# EAGLE design EggDuino77 (EAGLE 7.7.0)
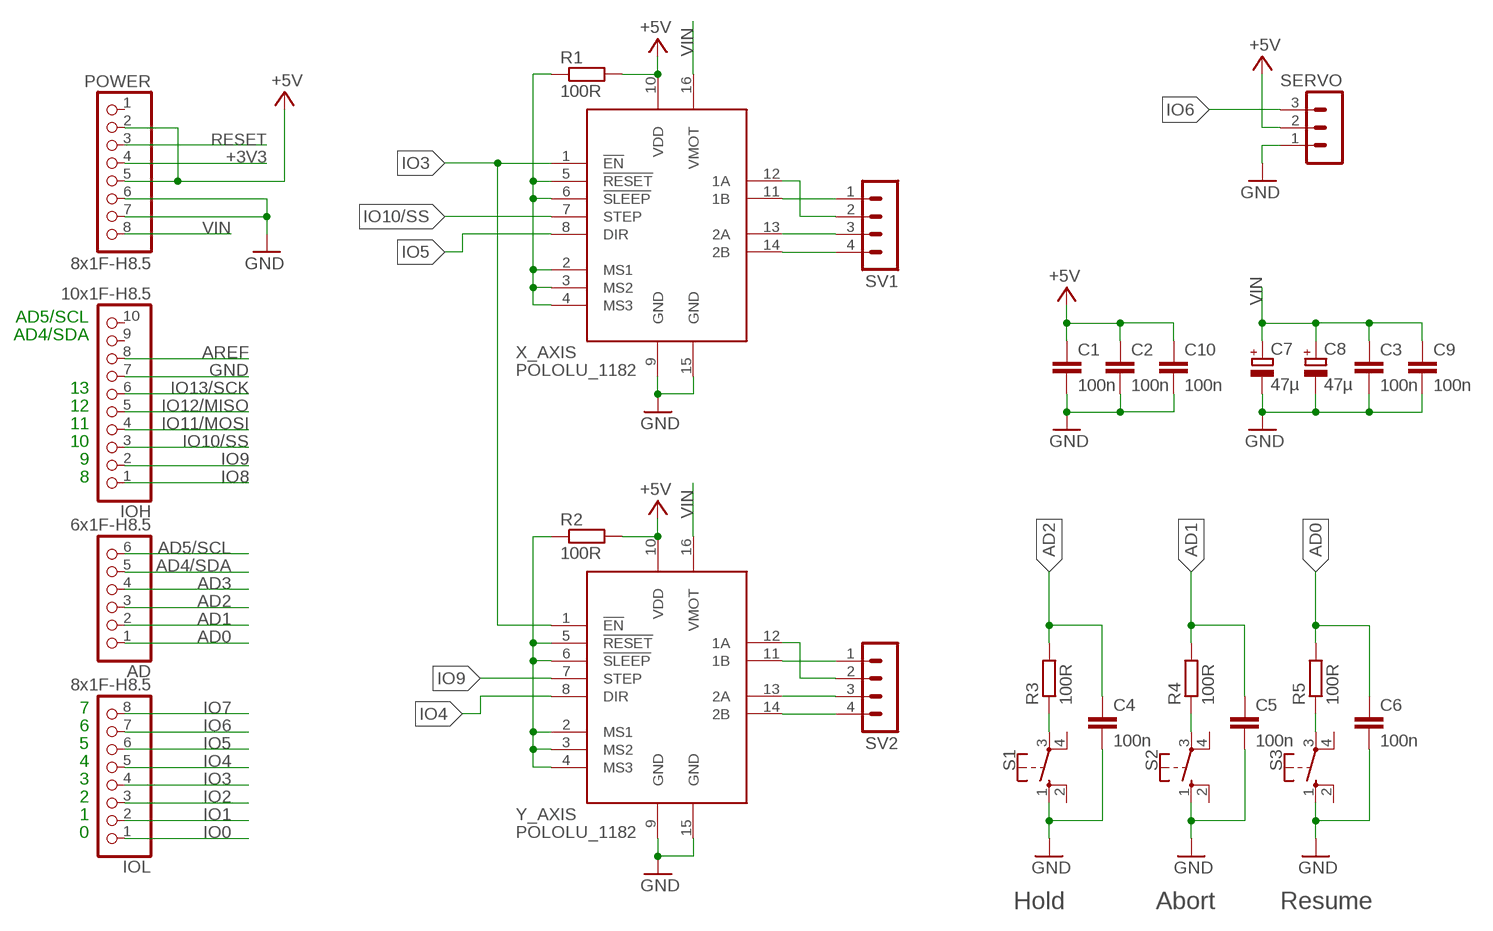
[diagram p0: schematic, sheet 1]

## Parts
AD  6x1F-H8.5  PINHD-1X6  [1X06]
C1  100n  C-EUC0805  [C0805]
C2  100n  C-EUC0805  [C0805]
C3  100n  C-EUC0805  [C0805]
C4  100n  C-EUC0805  [C0805]
C5  100n  C-EUC0805  [C0805]
C6  100n  C-EUC0805  [C0805]
C7  47µ  CPOL-EUE2,5-6E  [E2,5-6E]
C8  47µ  CPOL-EUE2,5-6E  [E2,5-6E]
C9  100n  C-EUC0805  [C0805]
C10  100n  C-EUC0805  [C0805]
IOH  10x1F-H8.5  PINHD-1X10_ARD  [1X10]
IOL  8x1F-H8.5  PINHD-1X8  [1X08]
POWER  8x1F-H8.5  PINHD-1X8  [1X08]
R1  100R  R-EU_R0805  [R0805]
R2  100R  R-EU_R0805  [R0805]
R3  100R  R-EU_R0805  [R0805]
R4  100R  R-EU_R0805  [R0805]
R5  100R  R-EU_R0805  [R0805]
S1  10-XX  [B3F-10XX]
S2  10-XX  [B3F-10XX]
S3  10-XX  [B3F-10XX]
SERVO  MA03-1  [MA03-1]
SV1  MA04-1  [MA04-1]
SV2  MA04-1  [MA04-1]
X_AXIS  POLOLU_1182  [DIL16_WIDE]
Y_AXIS  POLOLU_1182  [DIL16_WIDE]

## Nets
+3V3: POWER.4
+5V [usbvcc]: C1.1 C2.1 C10.1 POWER.2 POWER.5 R1.2 R2.2 SERVO.2 X_AXIS.10(VDD) Y_AXIS.10(VDD)
AD0: AD.1 C6.1 R5.2
AD1: AD.2 C5.1 R4.2
AD2: AD.3 C4.1 R3.2
AD3: AD.4
AD4/SDA: AD.5
AD5/SCL: AD.6
AREF [aref]: IOH.8
GND [gnd]: C1.2 C2.2 C3.2 C4.2 C5.2 C6.2 C7.- C8.- C9.2 C10.2 IOH.7 POWER.6 POWER.7 S1.1(S) S2.1(S) S3.1(S) SERVO.1 X_AXIS.9(GND) X_AXIS.15(GND) Y_AXIS.9(GND) Y_AXIS.15(GND)
IO0: IOL.1
IO1: IOL.2
IO2: IOL.3
IO3: IOL.4 X_AXIS.1(!EN) Y_AXIS.1(!EN)
IO4: IOL.5 Y_AXIS.8(DIR)
IO5: IOL.6 X_AXIS.8(DIR)
IO6: IOL.7 SERVO.3
IO7: IOL.8
IO8: IOH.1
IO9: IOH.2 Y_AXIS.7(STEP)
IO10/SS: IOH.3 X_AXIS.7(STEP)
IO11/MOSI: IOH.4
IO12/MISO: IOH.5
IO13/SCK: IOH.6
N$1: R2.1 Y_AXIS.2(MS1) Y_AXIS.3(MS2) Y_AXIS.4(MS3) Y_AXIS.5(!RESET) Y_AXIS.6(!SLEEP)
N$2: R1.1 X_AXIS.2(MS1) X_AXIS.3(MS2) X_AXIS.4(MS3) X_AXIS.5(!RESET) X_AXIS.6(!SLEEP)
N$3: SV1.4 X_AXIS.14(2B)
N$4: SV1.3 X_AXIS.13(2A)
N$5: SV1.2 X_AXIS.12(1A)
N$6: SV1.1 X_AXIS.11(1B)
N$7: SV2.1 Y_AXIS.11(1B)
N$8: SV2.4 Y_AXIS.14(2B)
N$9: SV2.3 Y_AXIS.13(2A)
N$10: SV2.2 Y_AXIS.12(1A)
N$12: R3.1 S1.3(P)
N$15: R4.1 S2.3(P)
N$17: R5.1 S3.3(P)
RESET: POWER.3
VIN [power]: C3.1 C7.+ C8.+ C9.1 POWER.8 X_AXIS.16(VMOT) Y_AXIS.16(VMOT)
Unconnected: IOH.9 IOH.10 POWER.1 S1.2(S1) S1.4(P1) S2.2(S1) S2.4(P1) S3.2(S1) S3.4(P1)

## Notes on the sheet
- AD5/SCL
- AD4/SDA
- 13
- 12
- 11
- 10
- 9
- 8
- 7
- 6
- 5
- 4
- 3
- 2
- 1
- 0
- Hold | Abort | Resume

## Library data of the parts
AD = SmartPrj:PINHD-1X6: PIN HEADER
C1-C6 C9 C10 = rcl:C-EU: CAPACITOR, European symbol; OC_RS: KEM X7R0805 100N
C7 C8 = rcl:CPOL-EU: POLARIZED CAPACITOR, European symbol; OC_RS: RAD LXZ 50/47
IOH = SmartPrj:PINHD-1X10_ARD: PIN HEADER
IOL POWER = SmartPrj:PINHD-1X8: PIN HEADER
R1-R5 = rcl:R-EU_: RESISTOR, European symbol; OC_RS: SMD-0805 100
S1-S3 = switch-omron:10-XX: OMRON SWITCH; OC_RS: TASTER 9302
SERVO = con-lstb:MA03-1: PIN HEADER; OC_FARNELL: unknown; OC_NEWARK: unknown
SV1 SV2 = con-lstb:MA04-1: PIN HEADER; OC_FARNELL: unknown; OC_NEWARK: unknown
X_AXIS Y_AXIS = EggDuino77:POLOLU_1182: Pololu stepper driver based on the A4983.

## Net classes
0 default: width 0.254 mm, clearance 0.254 mm
1 power: width 0.61 mm, drill 0.61 mm, clearance 0.254 mm
2 gnd: width 0.305 mm, drill 0.559 mm, clearance 0.254 mm
3 usbvcc: width 0.508 mm, drill 0.61 mm, clearance 0.254 mm
4 aref: width 0.406 mm, drill 0.61 mm, clearance 0.254 mm

## Board
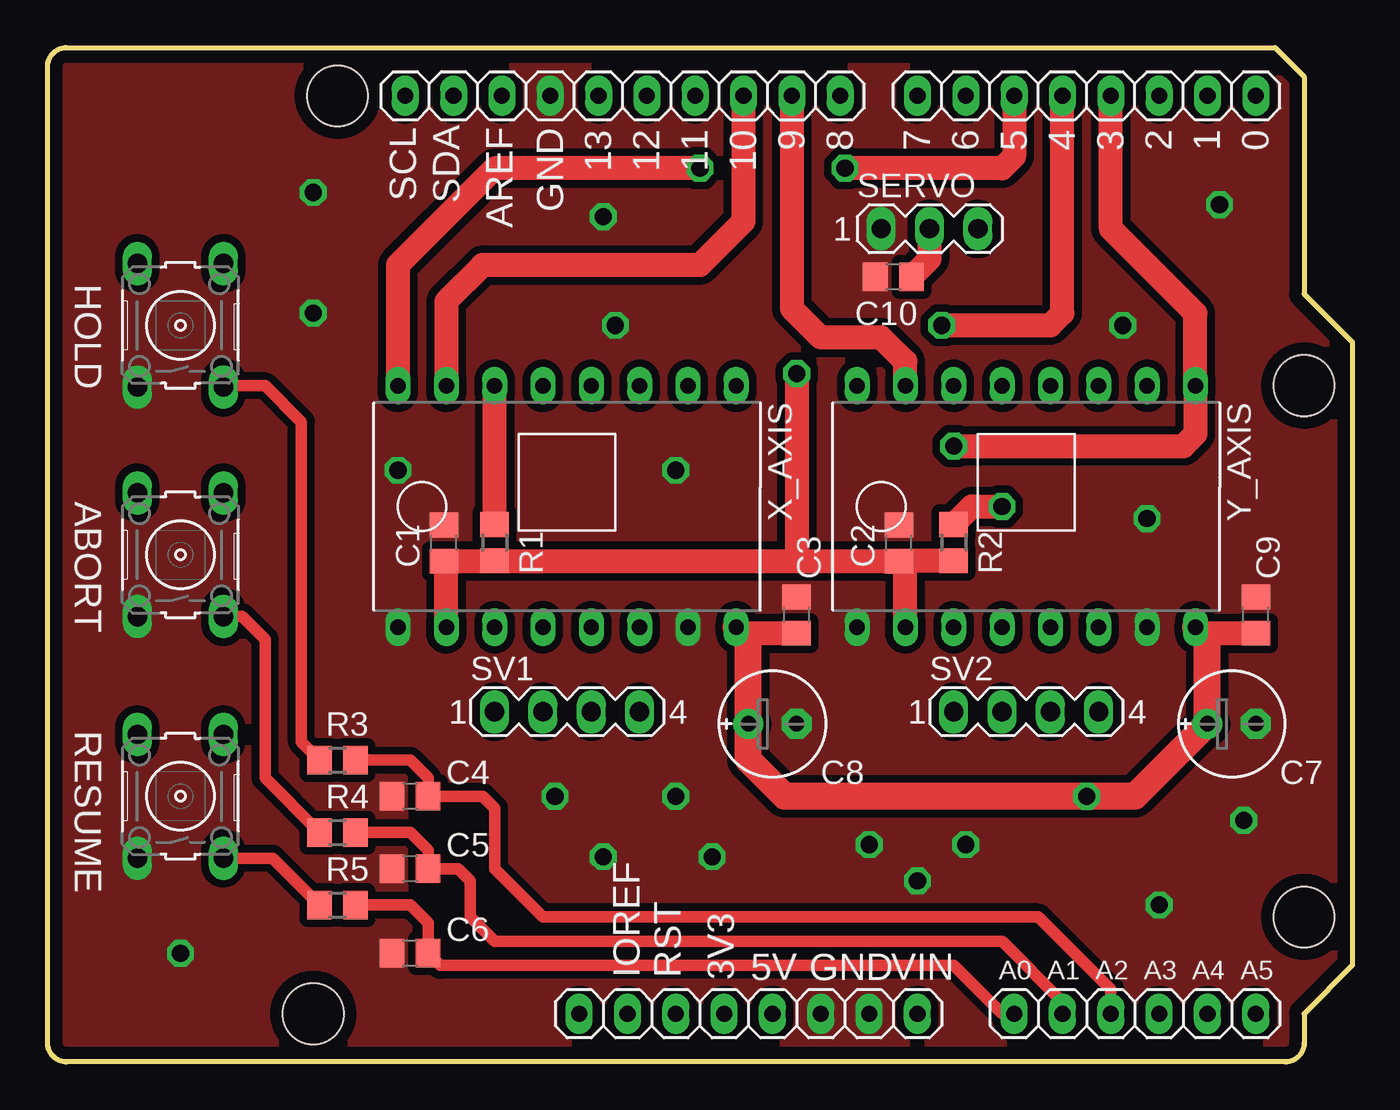
[diagram p1: board, top side]
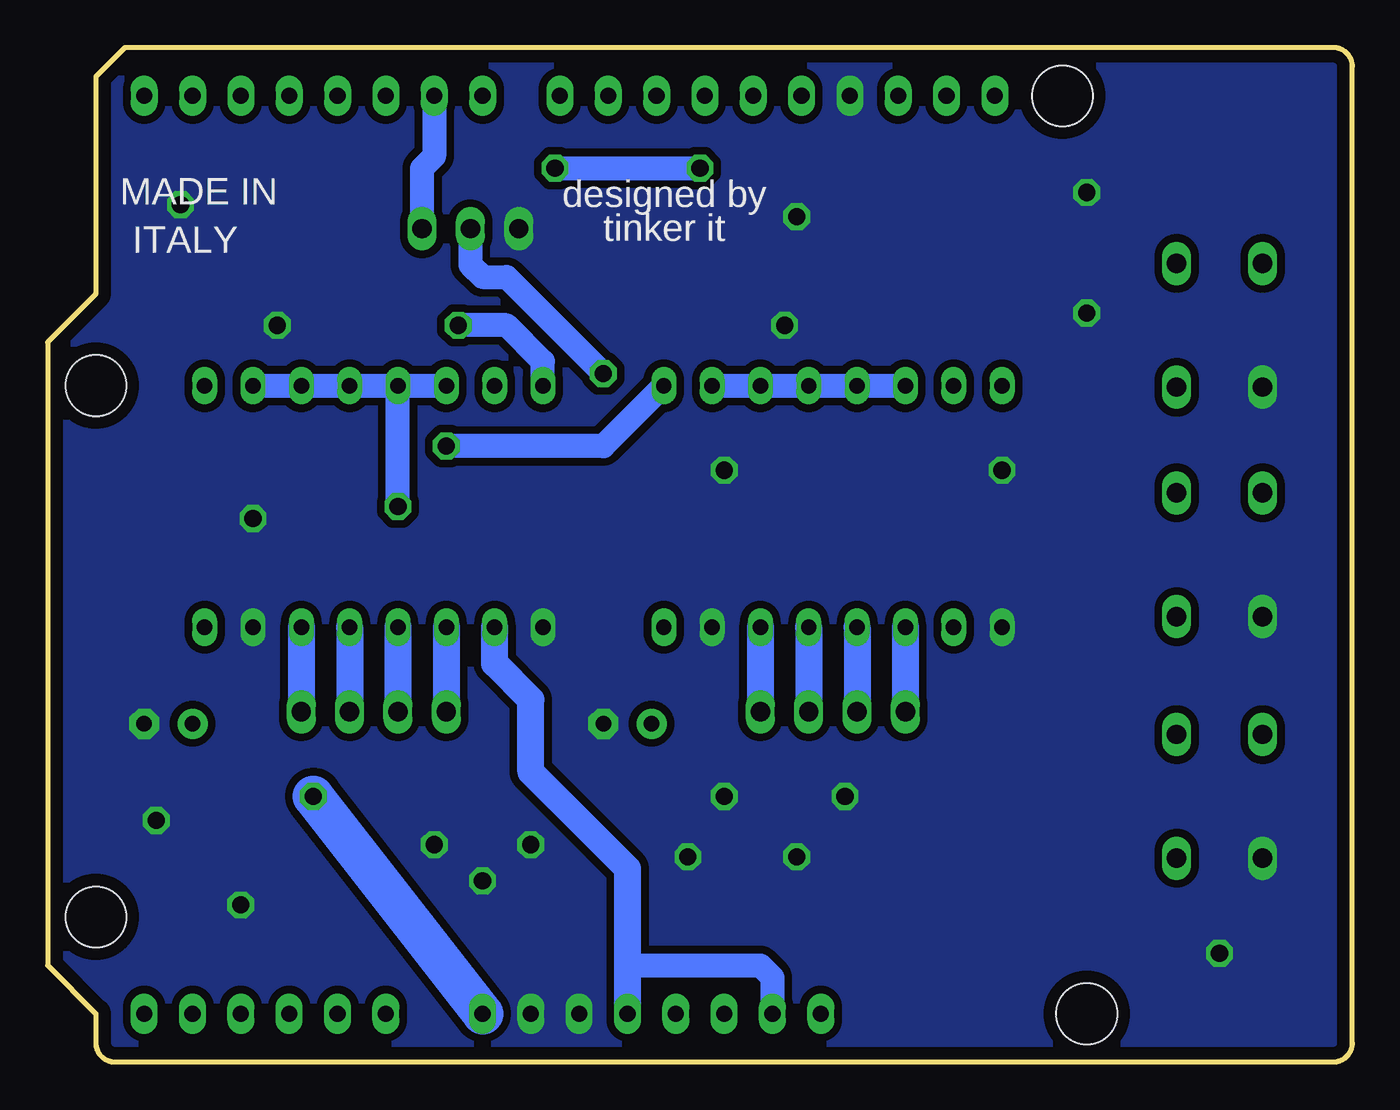
[diagram p2: board, bottom side, seen from below]

Size 68.58 x 53.34 mm. Coordinates in mm from the lower left corner, seen from the top.
Outline: 64.52,53.34 66.04,51.82 66.04,40.39 68.58,37.85 68.58,5.08 66.04,2.54 66.04,1 arc-90 65.04,0 1,0 arc-90 0,1 0,52.34 arc-90 1,53.34 64.52,53.34
Copper layers (1*16): Top 0.035mm / dielectric 1.5mm / Bottom 0.035mm
Design rules "default": minimum track width 10mil, minimum drill 22mil, track to track 10mil, track to pad 10mil, pad to pad 10mil, via to via 12mil, smd to smd 8mil, copper to edge 26mil, drill to drill 12mil, minimum pad ring 10mil, minimum via ring 10mil, stop-mask expansion 1mil, vias tented up to drill 30mil, thermal gap 10mil
Holes 3.2 mm at 66.04,35.56 66.04,7.62 15.24,50.8 13.97,2.54
vRestrict: area 22.9,44.1 to 24.6,49.1; area 25.4,45.5 to 27.1,49.1; area 28.4,45.3 to 29.6,48.8; area 31,45.3 to 32.1,48.8; area 33.5,45.3 to 34.7,48.8; area 36.1,45.3 to 37.2,48.8; area 38.7,47.2 to 39.9,48.8; area 40.3,45.1 to 47.6,46.9; area 60.3,44.2 to 61.7,46.7; area 62.9,44.2 to 64.3,46.7; area 61.3,35.8 to 64.8,37.2; area 0.6,21.8 to 2,30.1; 14 more areas

### Footprints (pad centres in the part's own frame; a part is rotated, then mirrored left to right if it is on the bottom)
1X06 = drill 0.85 pad 1.422 long: 1 -6.35,0; 2 -3.81,0; 3 -1.27,0; 4 1.27,0; 5 3.81,0; 6 6.35,0
C0805 = smd 1.3 x 1.5: 1 -0.95,0; 2 0.95,0
E2,5-6E = drill 0.813 pad 1.575: + -1.27,0 | drill 0.813 pad 1.575 octagon: - 1.27,0
1X10 = drill 0.85 pad 1.422 long: 1 -11.43,0; 2 -8.89,0; 3 -6.35,0; 4 -3.81,0; 5 -1.27,0; 6 1.27,0; 7 3.81,0; 8 6.35,0; 9 8.89,0; 10 11.43,0
1X08 = drill 0.85 pad 1.422 long: 1 -8.89,0; 2 -6.35,0; 3 -3.81,0; 4 -1.27,0; 5 1.27,0; 6 3.81,0; 7 6.35,0; 8 8.89,0
R0805 = smd 1.3 x 1.5: 1 -0.95,0; 2 0.95,0
B3F-10XX = drill 1.016 long: 1 -3.251,2.261; 2 3.251,2.261; 3 -3.251,-2.261; 4 3.251,-2.261
MA03-1 = drill 1.016 long: 1 -2.54,0; 2 0,0; 3 2.54,0
MA04-1 = drill 1.016 long: 1 -3.81,0; 2 -1.27,0; 3 1.27,0; 4 3.81,0
DIL16_WIDE = drill 0.813 long: 1 -8.89,-3.81; 2 -6.35,-3.81; 3 -3.81,-3.81; 4 -1.27,-3.81; 5 1.27,-3.81; 6 3.81,-3.81; 7 6.35,-3.81; 8 8.89,-3.81; 9 8.89,8.89; 10 6.35,8.89; 11 3.81,8.89; 12 1.27,8.89; 13 -1.27,8.89; 14 -3.81,8.89; 15 -6.35,8.89; 16 -8.89,8.89

### Placement (x,y rotation side)
AD  57.15,2.54 0 top
C1  20.82,27.28 90 top
C2  44.74,27.28 90 top
C3  39.37,23.5 90 top
C4  19.05,13.97 180 top
C5  19.05,10.16 180 top
C6  19.05,5.71 180 top
C7  62.23,17.78 0 top
C8  38.1,17.78 0 top
C9  63.5,23.5 90 top
C10  44.45,41.27 180 top
IOH  30.23,50.8 180 top
IOL  54.61,50.8 180 top
POWER  36.83,2.54 0 top
R1  23.5,27.3 270 top
R2  47.62,27.3 270 top
R3  15.24,15.88 0 top
R4  15.24,12.06 0 top
R5  15.24,8.26 0 top
S1  6.99,38.73 90 top
S2  6.99,26.67 90 top
S3  6.99,13.97 90 top
SERVO  46.35,43.81 0 top
SV1  27.3,18.41 0 top
SV2  51.44,18.41 0 top
X_AXIS  27.3,31.75 180 top
Y_AXIS  51.44,31.75 180 top

### Tracks (layer width: path | path; a pad name or v marks a point on that pad's centre or on a via)
+5V  (via drill 0.9)
  Top 1.27: Y_AXIS.10 45.09,25.98 C2.1 | X_AXIS.10 20.95,26.2 C1.1 23.47,26.33 R1.2 39.37,26.36 | R2.2 44.77,26.36 C2.1 | 39.37,26.36 44.72,26.36 C2.1 | v39.37,36.2 39.37,26.36 | C10.1 46.35,42.23 SERVO.2
  Bottom 1.27: SERVO.2 46.35,41.91 45.72,41.27 44.45,41.27 v39.37,36.2 | POWER.5 38.1,5.08 31.11,5.08 30.48,4.45 POWER.2
  Bottom 1.422: POWER.5 38.1,10.16 43.18,15.24 43.18,19.05 45.09,20.95 Y_AXIS.10
AD0
  Top 0.61: AD.1 50.16,2.54 47.62,5.08 20.64,5.08 C6.1 20,7.3 19.05,8.26 R5.2
AD1
  Top 0.61: AD.2 53.34,3.17 50.16,6.35 23.5,6.35 22.23,7.62 22.23,9.53 21.59,10.16 C5.1 20,11.12 19.05,12.06 R4.2
AD2
  Top 0.61: AD.3 55.88,3.81 52.07,7.62 26.04,7.62 23.5,10.16 23.5,13.34 22.86,13.97 C4.1 20,14.93 19.05,15.88 R3.2
GND  (via drill 0.9)
  other vias: 43.18,11.43 48.26,11.43 45.72,9.53 26.67,13.97 33.02,13.97 29.21,10.79 34.92,10.79 58.42,8.26 62.87,12.7 33.02,31.11 57.78,28.57 29.21,44.45 29.84,38.73 56.52,38.73 13.97,39.37 13.97,45.72 6.99,5.71 61.59,45.09 18.41,31.11
  pour Bottom (isolate 0.406, rank 2, no thermals): 0.64,52.7 67.69,52.7 67.94,52.45 67.94,0.64 0.89,0.64 0.64,0.89 0.64,46.35
  pour Top (isolate 0.406, rank 2, no thermals): 0.64,52.7 67.94,52.7 67.94,0.64 0.64,0.64 0.51,30.48 0.64,46.35
IO3  (via drill 0.9)
  Top 1.27: IOL.4 55.88,43.81 60.33,39.37 Y_AXIS.1 60.33,33.02 59.69,32.38 v47.62,32.38
  Bottom 1.27: X_AXIS.1 39.37,32.38 v47.62,32.38
IO4  (via drill 0.9)
  Top 1.27: v46.99,38.73 52.7,38.73 53.34,39.37 IOL.5
  Bottom 1.27: Y_AXIS.8 42.55,36.83 44.45,38.73 v46.99,38.73
IO5  (via drill 0.9)
  Top 1.27: IOL.6 50.8,47.62 50.16,46.99 v41.91,46.99 | v34.29,46.99 23.5,46.99 18.41,41.91 X_AXIS.8
  Bottom 1.27: v41.91,46.99 v34.29,46.99
IO6
  Bottom 1.27: IOL.7 48.26,47.62 48.58,47.31 48.9,46.99 SERVO.3
IO9
  Top 1.27: Y_AXIS.7 45.09,36.83 43.81,38.1 40.64,38.1 39.12,39.62 IOH.2
IO10/SS
  Top 1.27: IOH.3 36.58,44.2 34.29,41.91 22.86,41.91 20.95,40.01 X_AXIS.7
N$1  (via drill 0.9)
  Top 1.27: R2.1 48.58,29.21 v50.16,29.21
  Bottom 1.27: Y_AXIS.5 Y_AXIS.6 | Y_AXIS.2 Y_AXIS.3 Y_AXIS.4 Y_AXIS.5 | v50.16,29.21 Y_AXIS.5
N$2
  Top 1.27: R1.1 X_AXIS.6
  Bottom 1.27: X_AXIS.2 X_AXIS.3 X_AXIS.4 X_AXIS.5 X_AXIS.6
N$3
  Bottom 1.422: X_AXIS.14 SV1.4
N$4
  Bottom 1.422: X_AXIS.13 SV1.3
N$5
  Bottom 1.422: X_AXIS.12 SV1.2
N$6
  Bottom 1.422: X_AXIS.11 SV1.1
N$7
  Bottom 1.422: Y_AXIS.11 SV2.1
N$8
  Bottom 1.422: Y_AXIS.14 SV2.4
N$9
  Bottom 1.422: Y_AXIS.13 SV2.3
N$10
  Bottom 1.422: Y_AXIS.12 SV2.2
N$12
  Top 0.61: R3.1 13.34,16.83 13.34,33.66 11.43,35.56 9.32,35.56 S1.3
N$15
  Top 0.61: R4.1 11.43,14.93 11.43,22.23 10.24,23.42 S2.3
N$17
  Top 0.61: R5.1 11.83,10.72 S3.3
VIN  (via drill 0.9)
  Top 1.27: C3.1 36.51,22.55 X_AXIS.16 | C9.1 60.64,22.55 Y_AXIS.16
  Top 1.422: X_AXIS.16 36.83,22.23 C8.+ 36.83,15.88 38.73,13.97 v54.61,13.97 57.15,13.97 C7.+ 60.96,22.23 Y_AXIS.16
  Bottom 2.184: POWER.8 v54.61,13.97

### Text on the board
tPlace: 13 | 12 | 11 | 10 | 9 | 8 | 7 | 6 | 5 | 4 | 3 | 2 | 1 | 0
tNames: SCL | SDA | AREF | GND | HOLD | ABORT | RESUME | IOREF | RST | 3V3 | 5V | GND | VIN | A0 | A1 | A2 | A3 | A4 | A5
bNames: MADE IN | designed by | MADE IN | ITALY | tinker it | ITALY | designed by | tinker it | ATMEGA328
ReferenceLC: L | TX | ON | RX | PC1 | PC2
214bmp: D:/SmartProjects/Snc/a4_bn_logo2.bmp